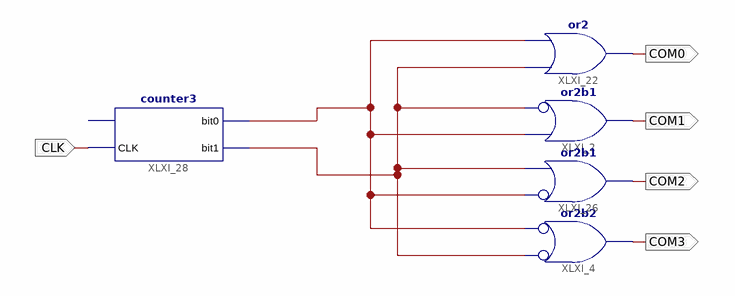
[diagram p0: schematic sheet 1]
// Xilinx ISE schematic comSEL.sch (spartan6) as structural Verilog: 5 symbols, 5 ports
module comSEL (
  input  CLK,
  output COM3,
  output COM2,
  output COM1,
  output COM0
);

  wire SEL0, SEL1;

  or XLXI_2 (COM1, ~SEL1, SEL0);  // or2b1
  or XLXI_4 (COM3, ~SEL1, ~SEL0);  // or2b2
  or XLXI_26 (COM2, ~SEL0, SEL1);  // or2b1
  or XLXI_22 (COM0, SEL1, SEL0);
  counter3 XLXI_28 (.CLK(CLK), .bit0(SEL0), .bit1(SEL1));  // open: CLR
endmodule
